# Altium schematic sheet control.SchDoc
size A3
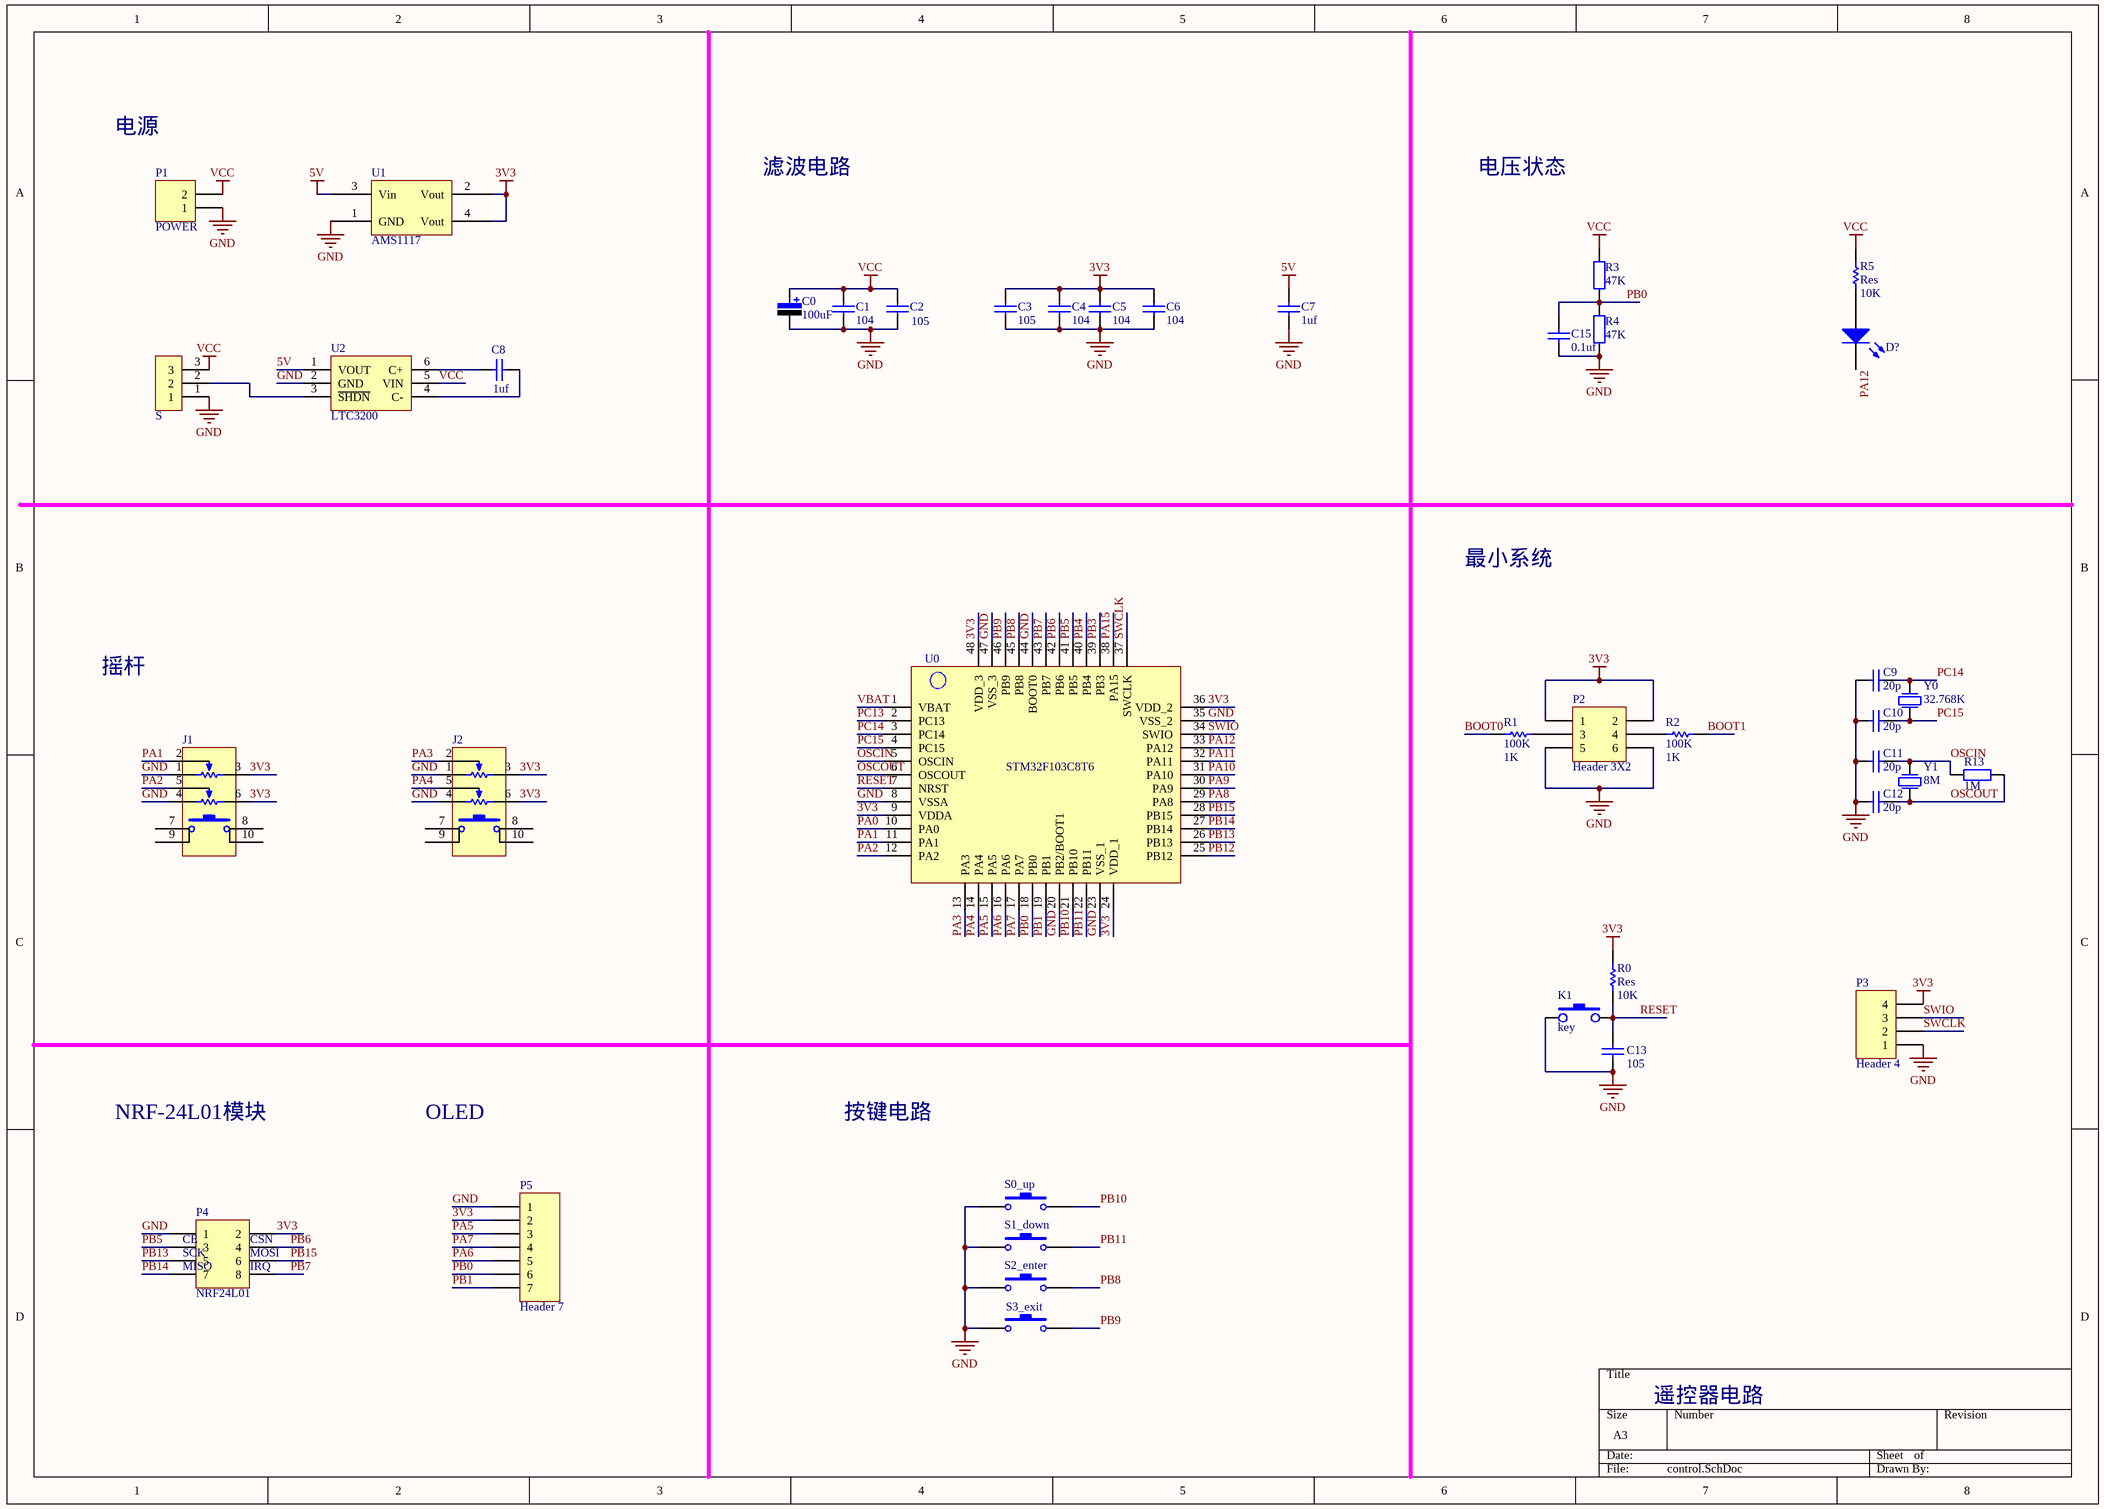
[diagram p0: control.SchDoc]

## Parts
C0  value 100uF  [1206C]  (hidden comment: Cap Pol)
C1  104  [C0603]
C2  value 105  [C0603]  (hidden comment: Cap)
C3  value 105  [C0603]  (hidden comment: Cap)
C4  value 104  [C0603]  (hidden comment: Cap)
C5  value 104  [C0603]  (hidden comment: Cap)
C6  value 104  [C0603]  (hidden comment: Cap)
C7  value 1uf  [C0603]  (hidden comment: Cap)
C8  value 1uf  [C0603]  (hidden comment: Cap)
C9  value 20p  [C0603]  (hidden comment: Cap)
C10  20p  [C0603]
C11  20p  [C0603]
C12  20p  [C0603]
C13  value 105  [C0603]  (hidden comment: Cap)
C15  value 0.1uf  [C0603]  (hidden comment: Cap)
D?  LED0  [LED_0805]  (value not drawn)
J1  JoyStick  [JoyStick]  (value not drawn)
J2  JoyStick  [JoyStick]  (value not drawn)
K1  key  [SW_PB2_A1]
P1  POWER  [HDR1X2]
P2  Header 3X2  [HDR2X3]
P3  Header 4  [HDR1X4]
P4  NRF24L01  [HDR2X4]
P5  Header 7  [HDR1X7]
R0  Res  value 10K  [0603_R]
R1  100K  value 1K  [0603R]
R2  100K  value 1K  [0603R]
R3  value 47K  [0603_R]  (hidden comment: Res1)
R4  value 47K  [0603_R]  (hidden comment: Res1)
R5  Res  value 10K  [0603_R]
R13  value 1M  [0603_R]  (hidden comment: Res2)
S  HEADER 3  [HDR1X3]  (value not drawn)
S0_up  SW-PB  [SW_PB2_A1]  (value not drawn)
S1_down  SW-PB  [SW_PB2_A1]  (value not drawn)
S2_enter  SW-PB  [SW_PB2_A1]  (value not drawn)
S3_exit  SW-PB  [SW_PB2_A1]  (value not drawn)
U0  Component_1  [LQFP-48_7x7x05P]  (value not drawn)
U1  AMS1117  [SOT223_N]
U2  LTC3200  [SOT-23-6]
Y0  32.768K  [HDR1X2]
Y1  8M  [XTAL]

## Nets
3V3: C3.2 C4.2 C5.2 C6.2 J1.3(TOP) J1.6(TOP) J2.3(TOP) J2.6(TOP) P2.1 P2.2 P3.4 P4.2 P5.2 R0.2 U0.9(VDDA) U0.24(VDD_1) U0.36(VDD_2) U0.48(VDD_3) U1.2(Vout) U1.4(Vout)
5V: C7.1 U1.3(Vin) U2.1(VOUT)
GND: C0.2 C1.1 C2.2 C3.1 C4.1 C5.1 C6.1 C7.2 C9.1 C10.1 C11.1 C12.1 C13.1 C15.1 J1.1(BOT) J1.4(BOT) J2.1(BOT) J2.4(BOT) K1.1 P1.1 P2.5 P2.6 P3.1 P4.1 P5.1 R4.1 S.1 S0_up.1 S1_down.1 S2_enter.1 S3_exit.1 U0.8(VSSA) U0.20(PB2/BOOT1) U0.23(VSS_1) U0.35(VSS_2) U0.44(BOOT0) U0.47(VSS_3) U1.1(GND) U2.2(GND)
VCC: C0.1 C1.2 C2.1 P1.2 R3.2 R5.2 S.3 U2.5(VIN)
BOOT0: R1.1
BOOT1: R2.2
OSCIN: C11.2 R13.2 U0.5(OSCIN) Y1.2
OSCOUT: C12.2 R13.1 U0.6(OSCOUT) Y1.1
PA0: U0.10(PA0)
PA1: J1.2(TAP) U0.11(PA1)
PA2: J1.5(TAP) U0.12(PA2)
PA3: J2.2(TAP) U0.13(PA3)
PA4: J2.5(TAP) U0.14(PA4)
PA5: P5.3 U0.15(PA5)
PA6: P5.5 U0.16(PA6)
PA7: P5.4 U0.17(PA7)
PA8: U0.29(PA8)
PA9: U0.30(PA9)
PA10: U0.31(PA10)
PA11: U0.32(PA11)
PA12: D?.2(K) U0.33(PA12)
PA15: U0.38(PA15)
PB0: C15.2 P5.6 R3.1 R4.2 U0.18(PB0)
PB1: P5.7 U0.19(PB1)
PB3: U0.39(PB3)
PB4: U0.40(PB4)
PB5: P4.3 U0.41(PB5)
PB6: P4.4 U0.42(PB6)
PB7: P4.8 U0.43(PB7)
PB8: S2_enter.2 U0.45(PB8)
PB9: S3_exit.2 U0.46(PB9)
PB10: S0_up.2 U0.21(PB10)
PB11: S1_down.2 U0.22(PB11)
PB12: U0.25(PB12)
PB13: P4.5 U0.26(PB13)
PB14: P4.7 U0.27(PB14)
PB15: P4.6 U0.28(PB15)
PC13: U0.2(PC13)
PC14: C9.2 U0.3(PC14) Y0.2
PC15: C10.2 U0.4(PC15) Y0.1
RESET: C13.2 K1.2 R0.1 U0.7(NRST)
SWCLK: P3.2 U0.37(SWCLK)
SWIO: P3.3 U0.34(SWIO)
VBAT: U0.1(VBAT)
NetC8_1: C8.1 U2.6(C+)
NetC8_2: C8.2 U2.4(C-)
NetD?_1: D?.1(A) R5.1
NetP2_3: P2.3 R1.2
NetP2_4: P2.4 R2.1
NetS_2: S.2 U2.3(~{SHDN})

Not connected (* = marked no-connect by the designer): J1 7 8 9 10; J2 7 8 9 10

## Notes on the sheet
- 电源
- 滤波电路
- 电压状态
- 最小系统
- 摇杆
- NRF-24L01模块
- OLED
- 按键电路
- (near P4) CE
- (near P4) SCK
- (near P4) CSN
- (near P4) MOSI
- (near P4) MISO
- (near P4) IRQ
- 遥控器电路
- (in symbol Component_1) STM32F103C8T6

## Library data of the parts
C0 = Cap Pol: 极性电解电容; Vol: 16V; Published: 8-Jun-2000; LatestRevisionDate: 17-Jul-2002; LatestRevisionNote: Re-released for DXP Platform.; PackageReference: RB7.6-15; Publisher: Altium Limited
C1 C10-C12 = CAP: Capacitor; Published: 8-Jun-2000; Revision: July-2002: Re-released for DXP Platform.; Publisher: Altium Limited
C2 C13 = Cap: 贴片电容; Published: 8-Jun-2000; LatestRevisionDate: 17-Jul-2002; LatestRevisionNote: Re-released for DXP Platform.; PackageReference: RAD-0.3; Publisher: Altium Limited
C3-C7 C9 C15 = Cap: 无极性电容; Published: 8-Jun-2000; LatestRevisionDate: 17-Jul-2002; LatestRevisionNote: Re-released for DXP Platform.; PackageReference: RAD-0.3; Publisher: Altium Limited
C8 = Cap: Capacitor; Published: 8-Jun-2000; LatestRevisionDate: 17-Jul-2002; LatestRevisionNote: Re-released for DXP Platform.; PackageReference: RAD-0.3; Publisher: Altium Limited; PackageDescription: Radial Cap, Thru-Hole; 2 Leads; 0.3 in Pin Spacing
D? = LED0: 发光二极管; Published: 8-Jun-2000; LatestRevisionDate: 08-Jul-2005; LatestRevisionNote: Mech Layer 1 removed.; PackageReference: LED-0; Publisher: Altium Limited
J1 J2 = JoyStick: 模拟摇杆
P1 = Header 2: Header, 2-Pin; LatestRevisionDate: 17-Jul-2002; LatestRevisionNote: Re-released for DXP Platform.; Publisher: Altium Limited
P2 = Header 3X2: Header, 3-Pin, Dual row; LatestRevisionDate: 17-Jul-2002; LatestRevisionNote: Re-released for DXP Platform.; Publisher: Altium Limited
P3 = Header 4: Header, 4-Pin; LatestRevisionDate: 17-Jul-2002; LatestRevisionNote: Re-released for DXP Platform.; Publisher: Altium Limited
P4 = Header 4X2: Header, 4-Pin, Dual row; LatestRevisionDate: 17-Jul-2002; LatestRevisionNote: Re-released for DXP Platform.; Publisher: Altium Limited
P5 = Header 7: Header, 7-Pin; LatestRevisionDate: 17-Jul-2002; LatestRevisionNote: Re-released for DXP Platform.; Publisher: Altium Limited
R0-R2 R5 = Res: 贴片电阻; Published: 8-Jun-2000; LatestRevisionDate: 17-Jul-2002; LatestRevisionNote: Re-released for DXP Platform.; PackageReference: AXIAL-0.3; Publisher: Altium Limited
R3 R4 = Res1: 贴片电阻; Published: 8-Jun-2000; LatestRevisionDate: 17-Jul-2002; LatestRevisionNote: Re-released for DXP Platform.; PackageReference: AXIAL-0.4; Publisher: Altium Limited
R13 = Res2: Resistor; Published: 8-Jun-2000; LatestRevisionDate: 17-Jul-2002; LatestRevisionNote: Re-released for DXP Platform.; Publisher: Altium Limited
S0_up S1_down S2_enter S3_exit = SW-PB: 微动开关; Published: 24-Mar-1999; LatestRevisionDate: 17-Jul-2002; LatestRevisionNote: Re-released for DXP Platform.; PackageReference: SPST-2; Publisher: Altium Limited
Y0 Y1 = XTAL